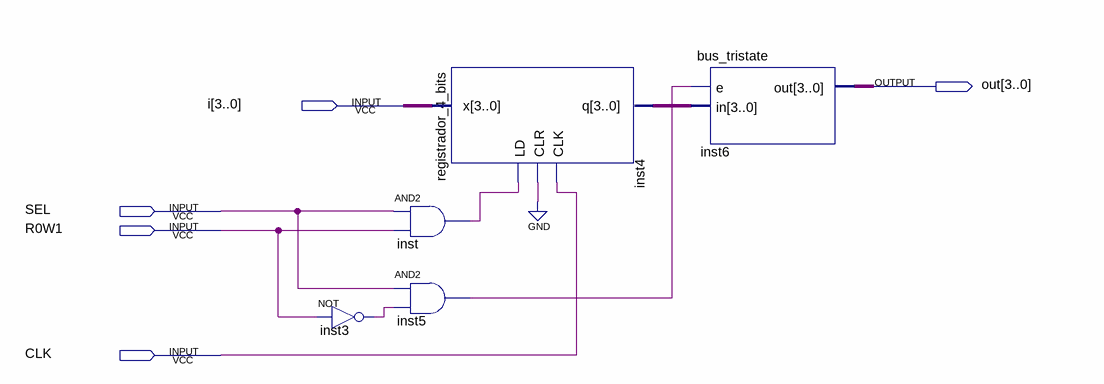
[diagram p0: schematic sheet]
// Quartus schematic ram1x4.bdf as structural Verilog: 5 symbols, 5 pins
module ram1x4 (
  input  [3:0] i,
  input  SEL,
  input  R0W1,
  input  CLK,
  output [3:0] out
);

  wire inst3_out, inst5_out, inst_out;
  wire [3:0] inst4_q;

  not inst3 (inst3_out, R0W1);
  and inst (inst_out, SEL, R0W1);
  and inst5 (inst5_out, SEL, inst3_out);
  registrador_4_bits inst4 (.x(i), .LD(inst_out), .CLR(1'b0), .CLK(CLK), .q(inst4_q));
  bus_tristate inst6 (.e(inst5_out), .in(inst4_q), .out(out));
endmodule
